# Altium project USB2.0拓展坞_Project.PrjPcb
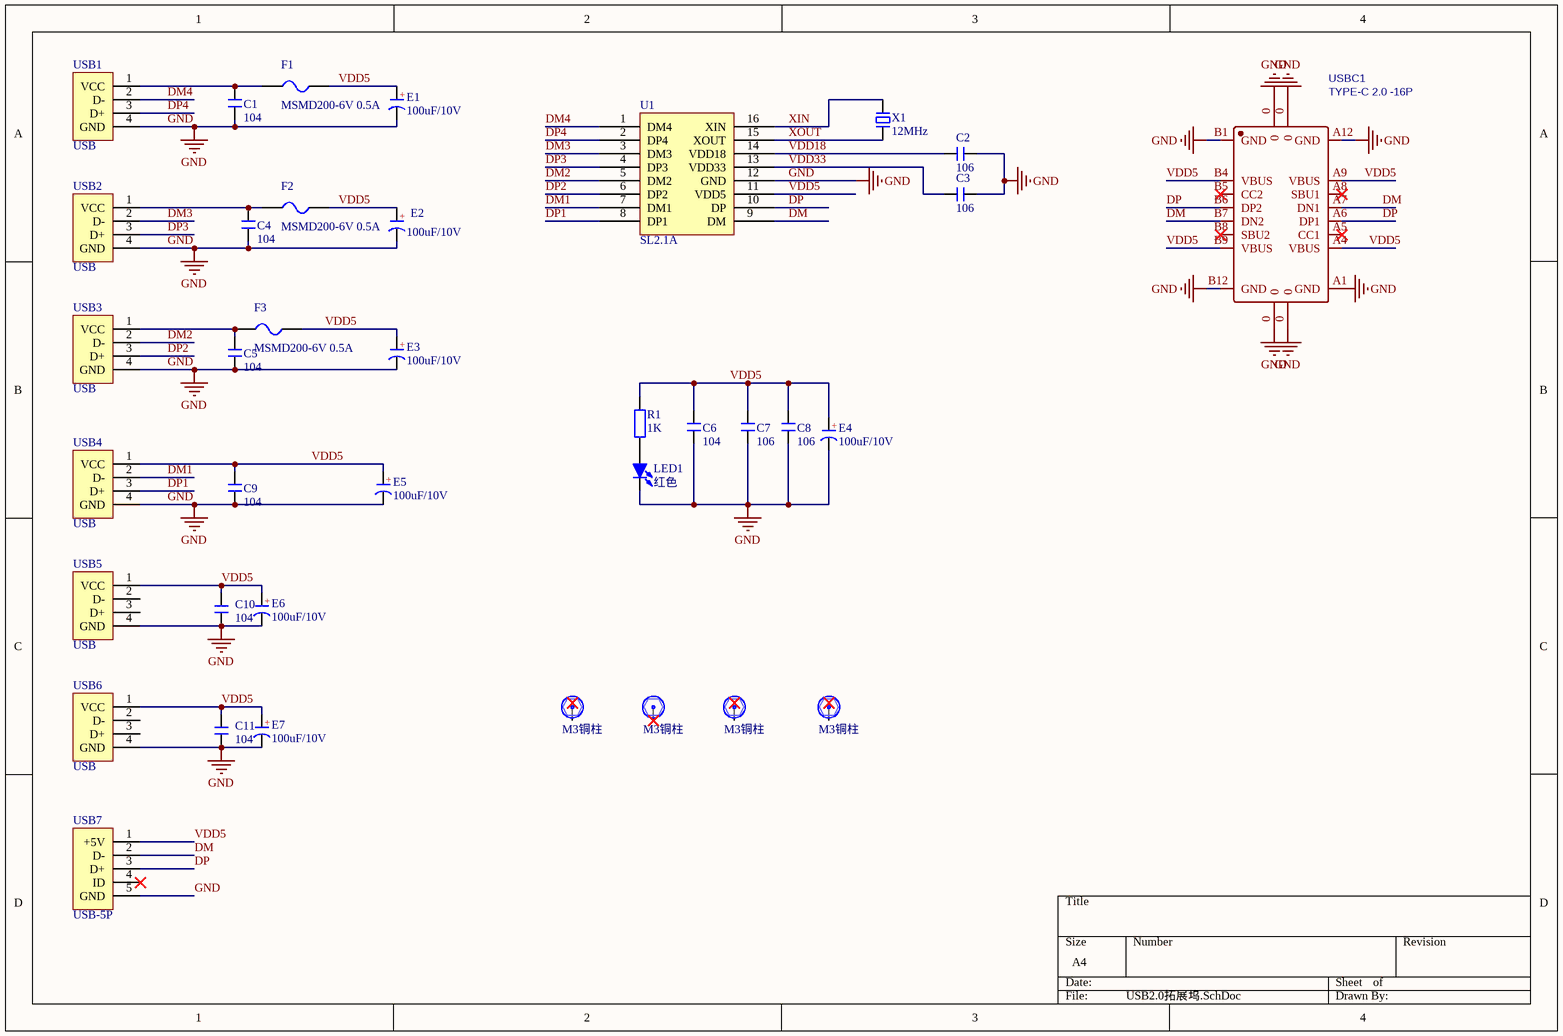
[diagram p0: USB2.0拓展坞.SchDoc]
1 sheet, 37 parts. Net scope: global (net labels, ports and power ports of the same name join across sheets).
Board file: USB2.0拓展坞.PcbDoc

## Sheet USB2.0拓展坞.SchDoc
size A4

### Parts
1  M3铜柱  [M3x4_L]
2  M3铜柱  [M3x4_L]
3  M3铜柱  [M3x4_L]
4  M3铜柱  [M3x4_L]
C1  104  [C 0603_L]
C2  106  [C 0603_L]
C3  106  [C 0603_L]
C4  104  [C 0603_L]
C5  104  [C 0603_L]
C6  104  [C 0603_L]
C7  106  [C 0603_L]
C8  106  [C 0603_L]
C9  104  [C 0603_L]
C10  104  [C 0603_L]
C11  104  [C 0603_L]
E1  100uF/10V  [CM C(5*5.4)]
E2  100uF/10V  [CM C(5*5.4)]
E3  100uF/10V  [CM C(5*5.4)]
E4  100uF/10V  [CM C(5*5.4)]
E5  100uF/10V  [CM C(5*5.4)]
E6  100uF/10V  [CM C(5*5.4)]
E7  100uF/10V  [CM C(5*5.4)]
F1  MSMD200-6V 0.5A  [FU 0603]
F2  MSMD200-6V 0.5A  [FU 0603]
F3  MSMD200-6V 0.5A  [FU 0603]
LED1  红色  [LED 0603R]
R1  1K  [R 0603_L]
U1  SL2.1A  [SOP16]
USB1  USB  [USB-A/S_A]
USB2  USB  [USB-A/S_A]
USB3  USB  [USB-A/S_A]
USB4  USB  [USB-A/S_A]
USB5  USB  [USB-A/S_A]
USB6  USB  [USB-A/S_A]
USB7  USB-5P  [USB-MICRO_A]
USBC1  TYPE-C 2.0 -16P  [USB-C-SMD_TYPE-C-USB-5]
X1  12MHz  [OSC 5032-2P]

### Nets
GND: C1.1 C2.1 C3.1 C4.1 C5.2 C6.1 C7.2 C8.2 C9.1 C10.1 C11.1 E1.2(K) E2.2(K) E3.2(K) E4.2(K) E5.2(K) E6.2(K) E7.2(K) LED1.2(K) U1.12(GND) USB1.4(GND) USB2.4(GND) USB3.4(GND) USB4.4(GND) USB5.4(GND) USB6.4(GND) USB7.5(GND) USBC1.0 USBC1.A1(GND) USBC1.A12(GND) USBC1.B1(GND) USBC1.B12(GND)
DM: U1.9(DM) USB7.2(D-) USBC1.A7(DN1) USBC1.B7(DN2)
DM1: U1.7(DM1) USB4.2(D-)
DM2: U1.5(DM2) USB3.2(D-)
DM3: U1.3(DM3) USB2.2(D-)
DM4: U1.1(DM4) USB1.2(D-)
DP: U1.10(DP) USB7.3(D+) USBC1.A6(DP1) USBC1.B6(DP2)
DP1: U1.8(DP1) USB4.3(D+)
DP2: U1.6(DP2) USB3.3(D+)
DP3: U1.4(DP3) USB2.3(D+)
DP4: U1.2(DP4) USB1.3(D+)
VDD5: C6.2 C7.1 C8.1 C9.2 C10.2 C11.2 E1.1(A) E2.1(A) E3.1(A) E4.1(A) E5.1(A) E6.1(A) E7.1(A) F1.2 F2.2 F3.2 R1.2 U1.11(VDD5) USB4.1(VCC) USB5.1(VCC) USB6.1(VCC) USB7.1(+5V) USBC1.A4(VBUS) USBC1.A9(VBUS) USBC1.B4(VBUS) USBC1.B9(VBUS)
VDD18: C2.2 U1.14(VDD18)
VDD33: C3.2 U1.13(VDD33)
XIN: U1.16(XIN) X1.2
XOUT: U1.15(XOUT) X1.1
NetC1_2: C1.2 F1.1 USB1.1(VCC)
NetC4_2: C4.2 F2.1 USB2.1(VCC)
NetC5_1: C5.1 F3.1 USB3.1(VCC)
NetLED1_1: LED1.1(A) R1.1

Not connected (* = marked no-connect by the designer): 1 1; 2 1*; 3 1; 4 1; USB5 2(D-) 3(D+); USB6 2(D-) 3(D+); USB7 4(ID)*; USBC1 A5(CC1)* A8(SBU1)* B5(CC2)* B8(SBU2)*

### Notes on the sheet
- (in symbol CE_SMD) +

### Library data of the parts
1-4 = 铜柱小焊盘: 铜柱; 版权归属: 封装库来自淘宝 ID：黄晶宝石; 封装库来自淘宝卖家 ID：黄晶宝石: 其他店铺购入均为盗版，不享受售后技术支持服务，请立即申请退款; BOM名称: 铜柱; 技术支持，联系售后: https://shop463601444.taobao.com
C1-C11 = C: 贴片电容; BOM名称: 无极性贴片电容; 淘宝ID: 封装库来自淘宝 ID：黄晶宝石; 联系售后，技术支持: https://shop463601444.taobao.com; 唯一出售店铺网址: https://shop463601444.taobao.com
E1-E7 = CE_SMD: 贴片电解电容; 版权归属: 封装库来自淘宝 ID：黄晶宝石; BOM名称: 贴片电解电容; 联系售后: https://shop463601444.taobao.com
F1-F3 = FU: 贴片保险丝; 版权归属: 封装库来自淘宝卖家 ID：黄晶宝石; BOM名称: 贴片保险丝; 学习资源: https://shop463601444.taobao.com
LED1 = LED-SMD: 贴片LED; 版权归属: 封装库来自淘宝 ID：黄晶宝石; BOM名称: 贴片LED; 学习资源: https://shop463601444.taobao.com
R1 = R: 贴片电阻; 版权归属: 来自淘宝 ID：黄晶宝石; 封装库来自淘宝卖家 ID：黄晶宝石: 其他店铺购入均为盗版，不享受售后技术支持服务，请立即申请退款; BOM名称: 贴片电阻; 联系售后: https://shop463601444.taobao.com
USB1-USB6 = USB-A/S: USB-A型母接口; 版权归属: 封装库来自淘宝 ID：黄晶宝石; BOM名称: USB-A型母接口; 学习资源: https://shop463601444.taobao.com
USB7 = USB-5P: 微型USB母座; BOM名称: 微型USB母座; 学习资源: https://shop463601444.taobao.com
USBC1 = USB2.0 Type-C 16Pin母座: USB2.0 Type-C 母座 16Pin; BOM_Manufacturer: LCSC; BOM_Supplier: LCSC; BOM_Manufacturer Part: -; spicePre: U; spiceSymbolName: TYPE-C 3.1 -16P_C168689
X1 = XTAL-2P: 2脚无源脚晶振; 版权归属: 封装库来自淘宝卖家 ID：黄晶宝石; BOM名称: 2脚无源脚晶振; 学习资源: https://shop463601444.taobao.com